# Altium schematic sheet INTERFACE-COMMUNICATION.SchDoc
size A4
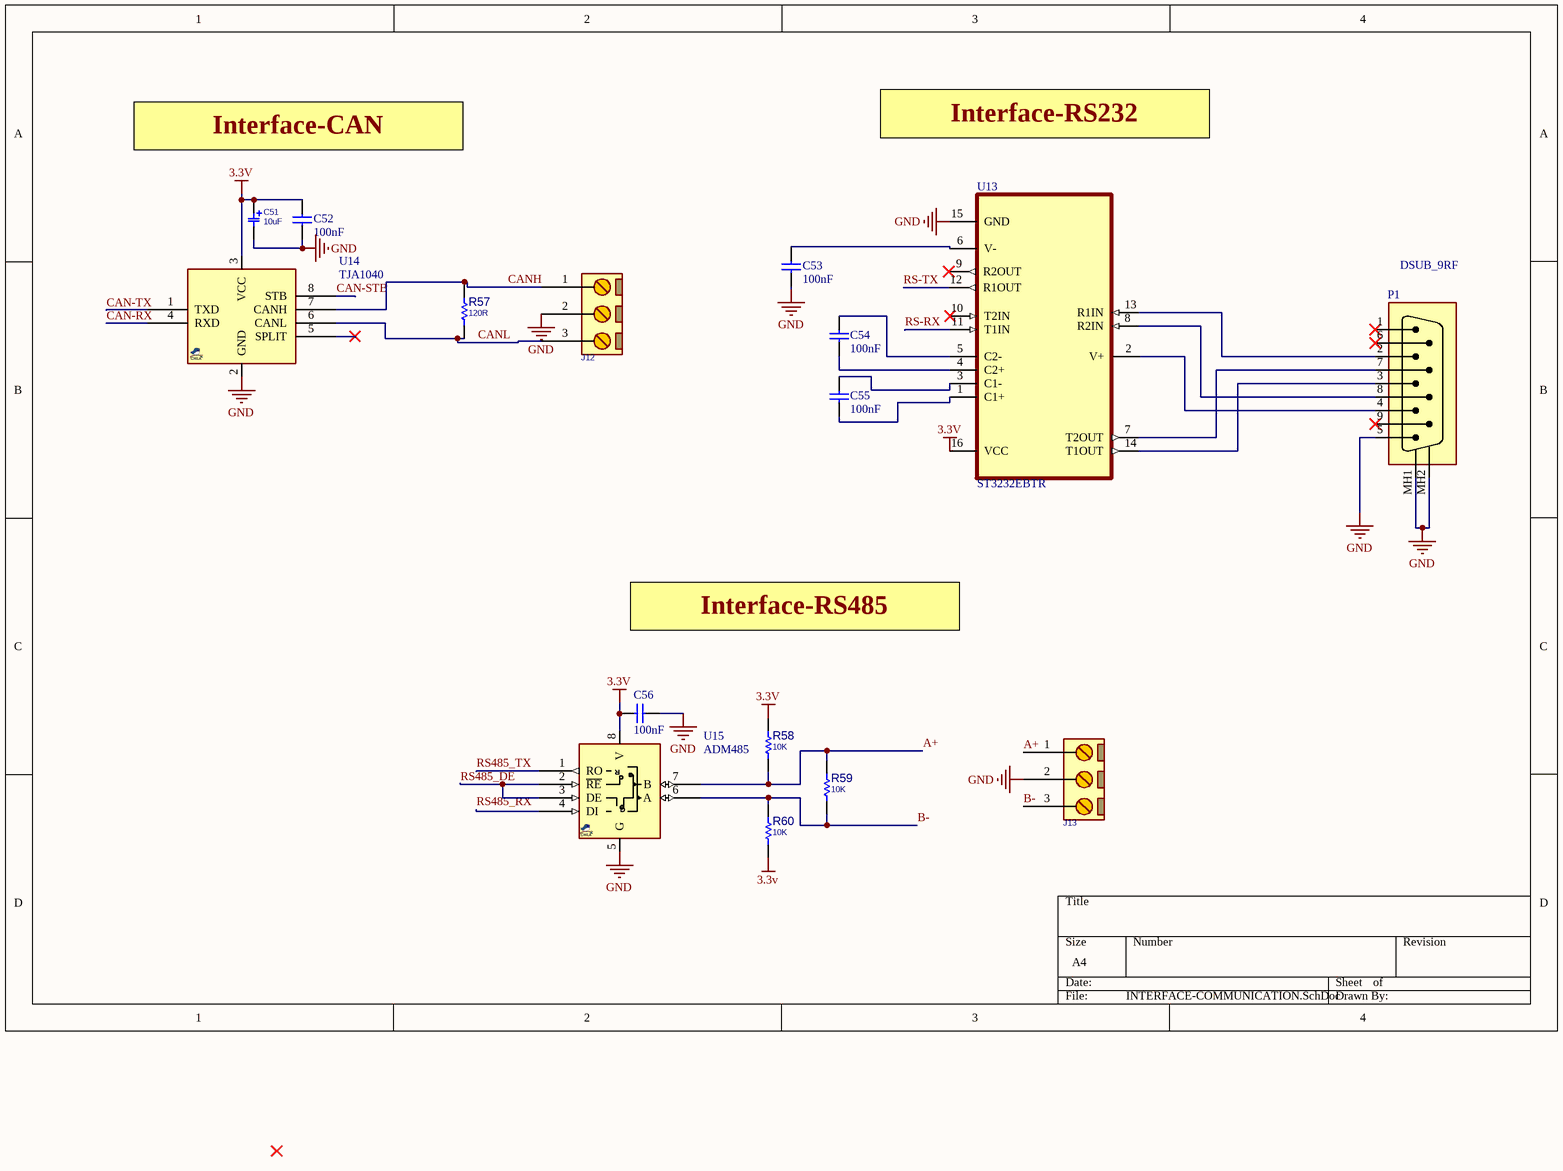
[diagram p0: INTERFACE-COMMUNICATION.SchDoc]

## Parts
C51  10uF  [C_TN_3216]
C52  100nF  [CAP0603]
C53  100nF  [CAP0603]
C54  100nF  [CAP0603]
C55  100nF  [CAP0603]
C56  100nF  [CAP0603]
J12  CONN_TB3  [MSTB_3]  (value not drawn)
J13  CONN_TB3  [MSTB_3]  (value not drawn)
P1  DSUB_9RF  [DSUB_9RF]
R57  120R  [R0402]
R58  10K  [R0402]
R59  10K  [R0402]
R60  10K  [R0402]
U13  ST3232EBTR  [SOP65P640X120-14N]
U14  TJA1040  [SO_8]
U15  ADM485  [SO_8]

## Nets
3.3V: C51.1 C52.1 C56.1 R58.2 R60.1 U13.16(VCC) U14.3(VCC) U15.8(V)
GND: C51.2 C52.2 C53.2 C56.2 J12.2 J13.2 P1.5 P1.MH1 P1.MH2 U13.15(GND) U14.2(GND) U15.5(G)
A+: J13.1 R58.1 R59.2 U15.7(B)
B-: J13.3 R59.1 R60.2 U15.6(A)
CAN-RX: U14.4(RXD)
CAN-STB: U14.8(STB)
CAN-TX: U14.1(TXD)
CANH: J12.1 R57.2 U14.7(CANH)
CANL: J12.3 R57.1 U14.6(CANL)
RS485_DE: U15.2(~{RE}) U15.3(DE)
RS485_RX: U15.4(DI)
RS485_TX: U15.1(RO)
RS-RX: U13.11(T1IN)
RS-TX: U13.12(R1OUT)
NetC53_1: C53.1 U13.6(V-)
NetC54_1: C54.1 U13.5(C2-)
NetC54_2: C54.2 U13.4(C2+)
NetC55_1: C55.1 U13.3(C1-)
NetC55_2: C55.2 U13.1(C1+)
NetP1_2: P1.2 U13.13(R1IN)
NetP1_3: P1.3 U13.14(T1OUT)
NetP1_4: P1.4 U13.2(V+)
NetP1_7: P1.7 U13.7(T2OUT)
NetP1_8: P1.8 U13.8(R2IN)

Not connected (* = marked no-connect by the designer): P1 1* 6* 9*; U13 9(R2OUT)* 10(T2IN)*; U14 5(SPLIT)*

## Notes on the sheet
- Interface-CAN
- Interface-RS232
- Interface-RS485
- (in symbol ADM485_SOP8) R; D

## Library data of the parts
C51 = CAP_SMD_TAN_10uF_10V: CAP, SMD, TAN; PARAM: 20%, 300mOhm, -55~105oC; MANF: VISHAY; MANF_P#: T55A106M010C0300; PARAM2: 10V; PRICE: 0.46$; VALUE: 10uF
C52-C56 = C0402-100n: 0.10µF 50V Ceramic Capacitor X7R 0603; Manufacturer Part Number: CL10B104KB8SFNC; Value: 100nF; Digi-Key Part Number: 1276-1936-1-ND
J12 J13 = CONN_MSTB_3: CONN, PHOENIX MSTB, 5-G, 5.08mm pitch; VALUE: CONN_TB3
P1 = CONN_DSUB_9RF: CONN, DSUB, HD, 9PIN, R/A, FEMALE, THD; MANF_P#: -; MANF: -; VALUE: DSUB_9RF
R57-R60 = RES_SMD: RESISTOR, SMD; PARAM: 0.063W; DESC: DESCRIPTION; DIST#: MOUSER; PARAM2: 1%; MANF_P#: -; MANF: -; ASSEMBLY: ASSEMBLY; PRICE: 100= 0.5$
  R57: VALUE: 120R
  R58-R60: VALUE: 10K
U13 = ST3232EBTR: 2/2 Transceiver Full RS232 16-TSSOP; MF: STMicroelectronics; SnapEDA_Link: https://www.snapeda.com/parts/ST3232EBTR/STMicroelectronics/view-part/?ref=snap; Availability: In Stock; Purchase-URL: https://pricing.snapeda.com/search/part/ST3232EBTR/?ref=eda; MP: ST3232EBTR; Value: *; Price: None; Package: TSSOP-16 STMicroelectronics; Check_prices: https://www.snapeda.com/parts/ST3232EBTR/STMicroelectronics/view-part/?ref=eda
U14 = TJA1040_SOP8: CAN, phy, High speed, 5V (VDD); MANF: NXP; MANF_P#: TJA1040T; PRICE: 4000toman@PAYA; PARAM2: 5V (VDD); PARAM: PARAM; VALUE: TJA1040
U15 = ADM485_SOP8: RS-485 Transceiver, 5V, SOP-8, ±7V Ground Difference Between Devices on the Bus; MANF_P#: ADM485AR; MANF: Analog Devices; PRICE: 4000toman@PAYA; VALUE: ADM485